# Altium schematic sheet lps22df.SchDoc
size A4; SheetNumber: 11; SheetTotal: 11
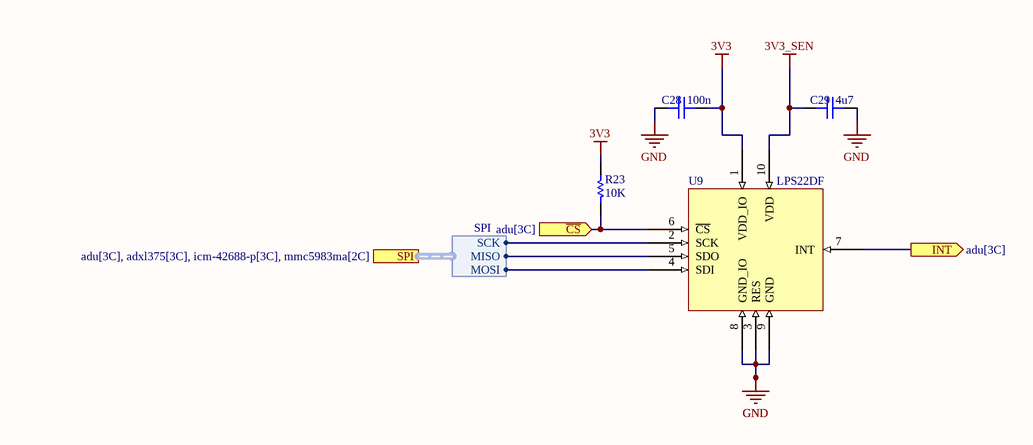
[diagram p0: lps22df.SchDoc]

## Parts
C28  100n  [CAP-0603-NP]
C29  4u7  [CAP-0603-NP]
R23  10K  [RES-0603]
U9  LPS22DF  [LPS22DF]

## Ports
INT (out, see adu[3C]), SPI (harness SPI, see adu[3C], adxl375[3C], icm-42688-p[3C], mmc5983ma[2C]), ~{CS} (in, see adu[3C])

## Harnesses
SPI: MISO, MOSI, SCK

## Nets
3V3: C28.2 R23.2 U9.1(VDD_IO)
3V3_SEN: C29.1 U9.10(VDD)
GND: C28.1 C29.2 U9.3(RES) U9.8(GND_IO) U9.9(GND)
~{CS}: R23.1 U9.6(~{CS}) ; port ~{CS}
INT: U9.7(INT) ; port INT
NetU9_2: U9.2(SCK) ; port SPI.SCK
NetU9_4: U9.4(SDI) ; port SPI.MOSI
NetU9_5: U9.5(SDO) ; port SPI.MISO

## Library data of the parts
C28 C29 = Capacitor
R23 = Resistor
U9 = LPS22DF: Low-power and high-precision MEMS nano pressure sensor: 260-1260 hPa absolute digital output barometer